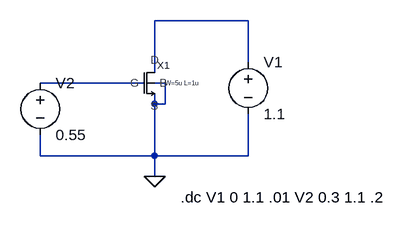
[diagram p0: schematic test1.asc]
test1.asc, the LTspice schematic file:
Version 4
SHEET 1 880 680
WIRE 208 64 64 64
WIRE 208 128 208 64
WIRE 64 144 64 64
WIRE 48 160 -112 160
WIRE 80 160 64 160
WIRE 64 192 64 176
WIRE 80 192 80 160
WIRE 80 192 64 192
WIRE -112 272 -112 240
WIRE 64 272 64 192
WIRE 64 272 -112 272
WIRE 208 272 208 208
WIRE 208 272 64 272
WIRE 64 304 64 272
FLAG 64 304 0
SYMBOL voltage 208 112 R0
WINDOW 123 0 0 Left 0
WINDOW 39 0 0 Left 0
SYMATTR InstName V1
SYMATTR Value 1.1
SYMBOL nmos65 80 160 R0
WINDOW 39 0 0 Left 0
SYMATTR InstName X1
SYMATTR SpiceLine W=5u L=1u
SYMBOL voltage -112 144 R0
WINDOW 123 0 0 Left 0
WINDOW 39 0 0 Left 0
SYMATTR InstName V2
SYMATTR Value 0.55
TEXT 104 336 Left 2 !.dc V1 0 1.1 .01 V2 0.3 1.1 .2

The netlist it stands for:
* test1.asc
V1 N001 0 1.1
XX1 N002 N001 0 0 nmos65 params: W=5u L=1u  ; pins G D S B
V2 N002 0 0.55
.dc V1 0 1.1 .01 V2 0.3 1.1 .2
.backanno
.end